# EAGLE design untitled (EAGLE 6.3)
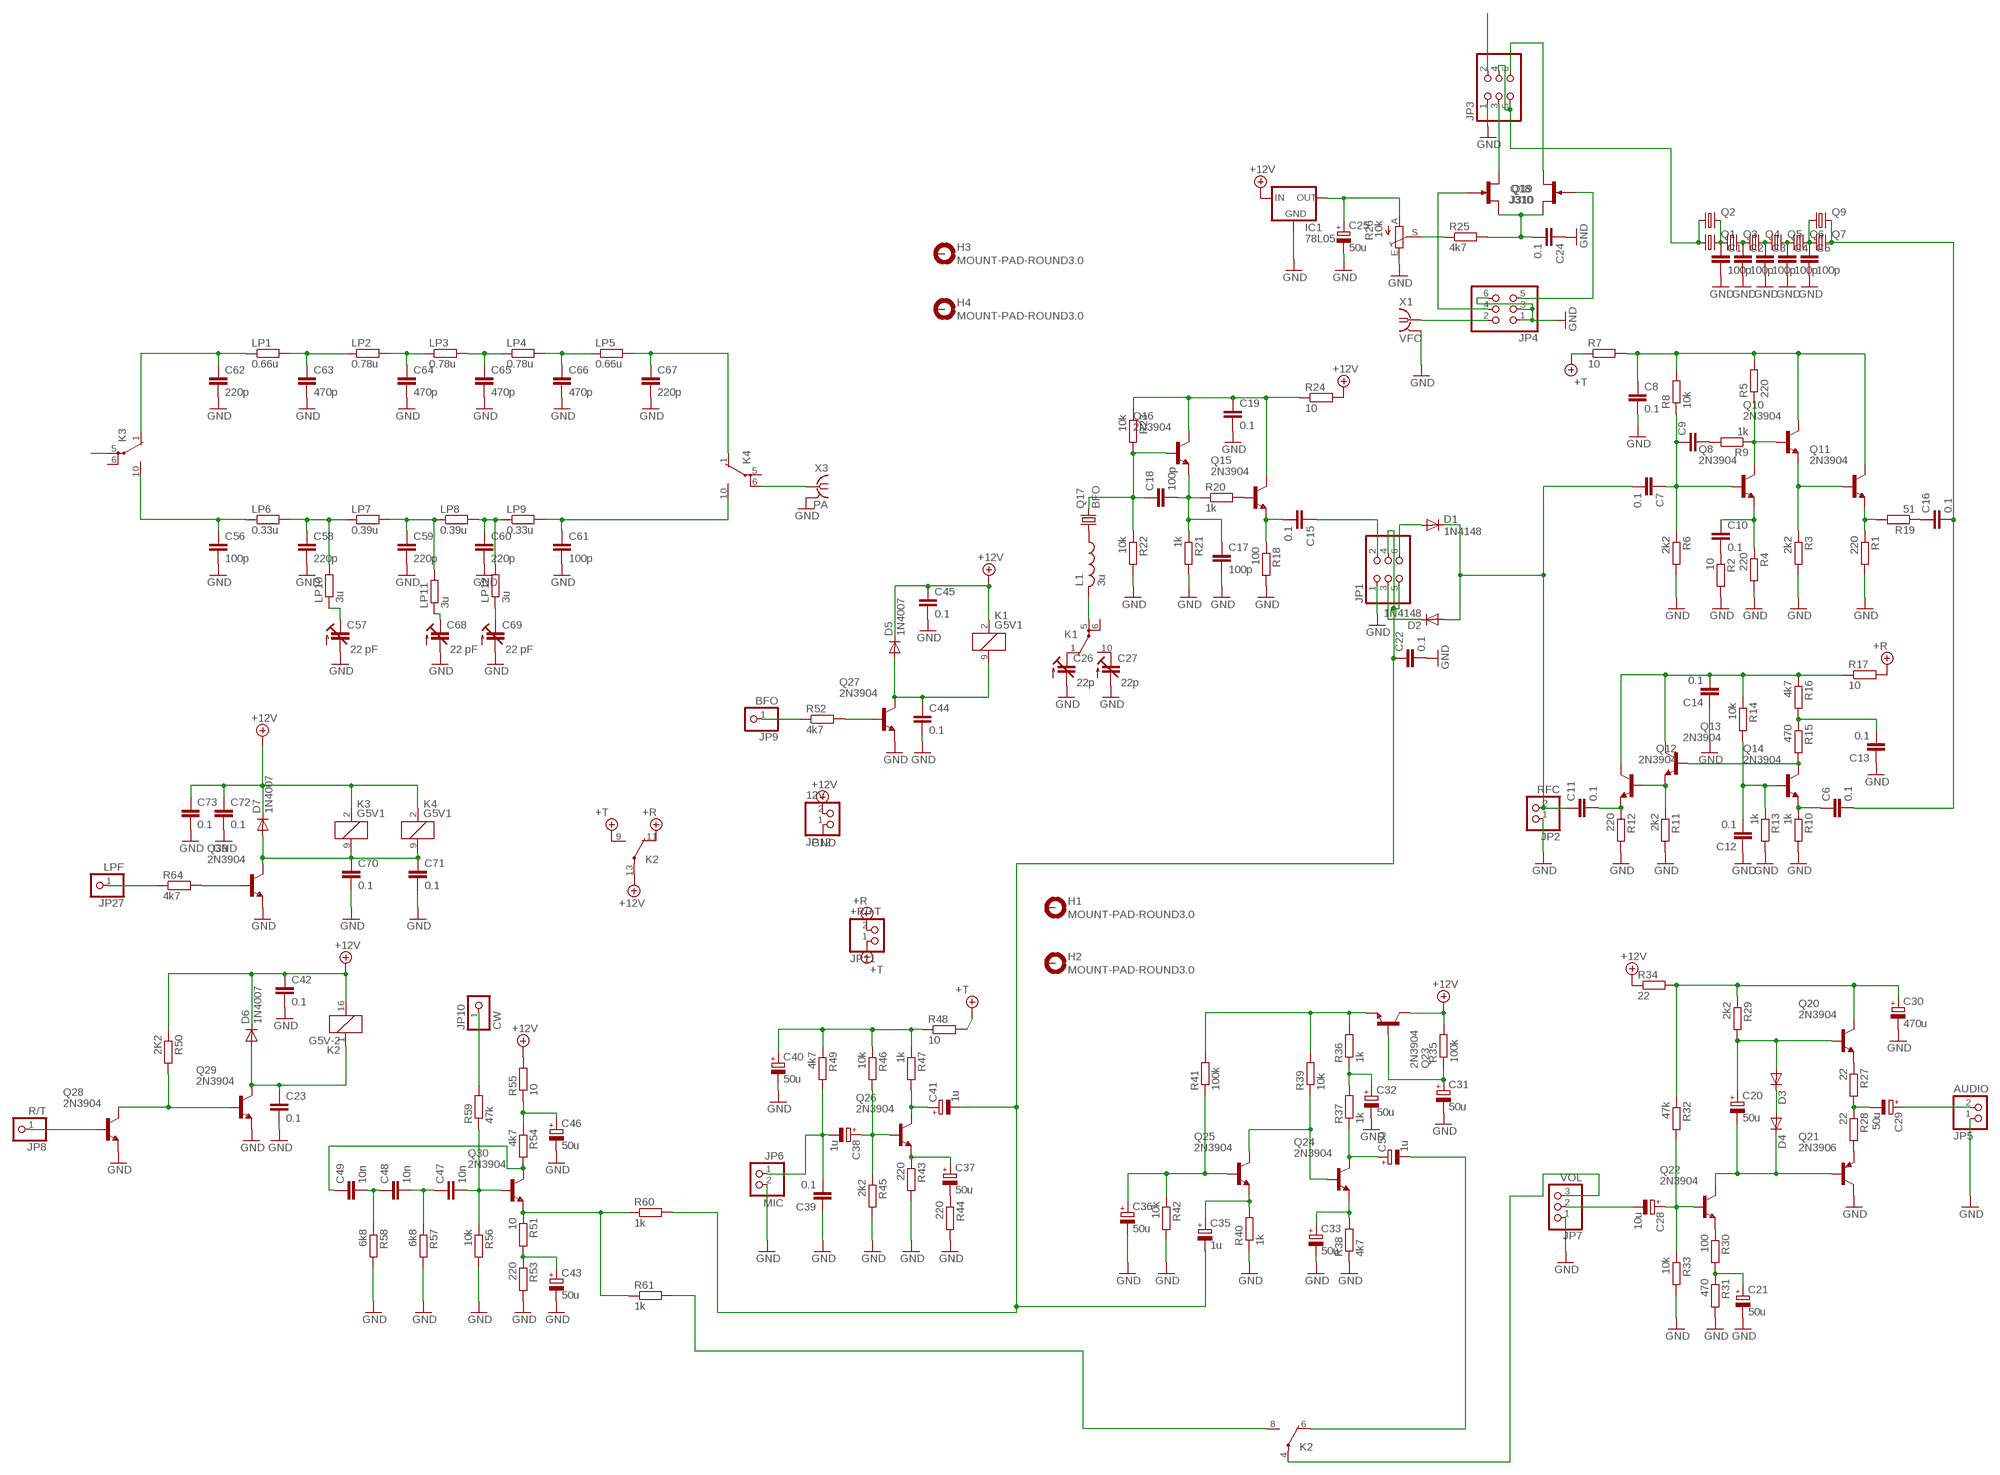
[diagram p0: schematic, sheet 1]

## Parts
C1  100p  C-EUC1206  [C1206]
C2  100p  C-EUC1206  [C1206]
C3  100p  C-EUC1206  [C1206]
C4  100p  C-EUC1206  [C1206]
C5  100p  C-EUC1206  [C1206]
C6  0.1  C-EU050-024X044  [C050-024X044]
C7  0.1  C-EU050-024X044  [C050-024X044]
C8  0.1  C-EU050-024X044  [C050-024X044]
C9  C-EU050-024X044  [C050-024X044]
C10  0.1  C-EU050-024X044  [C050-024X044]
C11  0.1  C-EU050-024X044  [C050-024X044]
C12  0.1  C-EU050-024X044  [C050-024X044]
C13  0.1  C-EU050-024X044  [C050-024X044]
C14  0.1  C-EU050-024X044  [C050-024X044]
C15  0.1  C-EU050-024X044  [C050-024X044]
C16  0.1  C-EU050-024X044  [C050-024X044]
C17  100p  C-EU050-024X044  [C050-024X044]
C18  100p  C-EU050-024X044  [C050-024X044]
C19  0.1  C-EU050-024X044  [C050-024X044]
C20  50u  CPOL-EUE2.5-5  [E2,5-5]
C21  50u  CPOL-EUE2.5-5  [E2,5-5]
C22  0.1  C-EU050-024X044  [C050-024X044]
C23  0.1  C-EU050-024X044  [C050-024X044]
C24  0.1  C-EU050-024X044  [C050-024X044]
C25  50u  CPOL-EUE2.5-5  [E2,5-5]
C26  22p  C-TRIMMTZ03  [CTRIMTZ03]
C27  22p  C-TRIMMTZ03  [CTRIMTZ03]
C28  10u  CPOL-EUE2.5-5  [E2,5-5]
C29  50u  CPOL-EUE2.5-5  [E2,5-5]
C30  470u  CPOL-EUE2.5-5  [E2,5-5]
C31  50u  CPOL-EUE2.5-5  [E2,5-5]
C32  50u  CPOL-EUE2.5-5  [E2,5-5]
C33  50u  CPOL-EUE2.5-5  [E2,5-5]
C35  1u  CPOL-EUE2.5-5  [E2,5-5]
C36  50u  CPOL-EUE2.5-5  [E2,5-5]
C37  50u  CPOL-EUE2.5-5  [E2,5-5]
C38  1u  CPOL-EUE2.5-5  [E2,5-5]
C39  0.1  C-EU050-024X044  [C050-024X044]
C40  50u  CPOL-EUE2.5-5  [E2,5-5]
C41  1u  CPOL-EUE2.5-5  [E2,5-5]
C42  0.1  C-EU050-024X044  [C050-024X044]
C43  50u  CPOL-EUE2.5-5  [E2,5-5]
C44  0.1  C-EU050-024X044  [C050-024X044]
C45  0.1  C-EU050-024X044  [C050-024X044]
C46  50u  CPOL-EUE2.5-5  [E2,5-5]
C47  10n  C-EU050-024X044  [C050-024X044]
C48  10n  C-EU050-024X044  [C050-024X044]
C49  10n  C-EU050-024X044  [C050-024X044]
C50  1u  CPOL-EUE5-4  [E5-4]
C56  100p  C-EU050-024X044  [C050-024X044]
C57  22 pF  C-TRIMMTZ03  [CTRIMTZ03]
C58  220p  C-EU050-024X044  [C050-024X044]
C59  220p  C-EU050-024X044  [C050-024X044]
C60  220p  C-EU050-024X044  [C050-024X044]
C61  100p  C-EU050-024X044  [C050-024X044]
C62  220p  C-EU050-024X044  [C050-024X044]
C63  470p  C-EU050-024X044  [C050-024X044]
C64  470p  C-EU050-024X044  [C050-024X044]
C65  470p  C-EU050-024X044  [C050-024X044]
C66  470p  C-EU050-024X044  [C050-024X044]
C67  220p  C-EU050-024X044  [C050-024X044]
C68  22 pF  C-TRIMMTZ03  [CTRIMTZ03]
C69  22 pF  C-TRIMMTZ03  [CTRIMTZ03]
C70  0.1  C-EU050-024X044  [C050-024X044]
C71  0.1  C-EU050-024X044  [C050-024X044]
C72  0.1  C-EU050-024X044  [C050-024X044]
C73  0.1  C-EU050-024X044  [C050-024X044]
D1  1N4148  DIODE-D-5  [D-5]
D2  1N4148  DIODE-D-5  [D-5]
D3  DIODE-D-5  [D-5]
D4  DIODE-D-5  [D-5]
D5  1N4007  DIODE-D-5  [D-5]
D6  1N4007  DIODE-D-5  [D-5]
D7  1N4007  DIODE-D-5  [D-5]
H1  MOUNT-PAD-ROUND3.0  [3,0-PAD]
H2  MOUNT-PAD-ROUND3.0  [3,0-PAD]
H3  MOUNT-PAD-ROUND3.0  [3,0-PAD]
H4  MOUNT-PAD-ROUND3.0  [3,0-PAD]
IC1  78L05  78LXX  [78LXX]
JP1  PINHD-2X3  [2X03]
JP2  RFC  PINHD-1X2  [1X02]
JP3  PINHD-2X3  [2X03]
JP4  PINHD-2X3  [2X03]
JP5  AUDIO  PINHD-1X2  [1X02]
JP6  MIC  PINHD-1X2  [1X02]
JP7  VOL  PINHD-1X3  [1X03]
JP8  R/T  PINHD-1X1  [1X01]
JP9  BFO  PINHD-1X1  [1X01]
JP10  CW  PINHD-1X1  [1X01]
JP11  +R/+T  PINHD-1X2  [1X02]
JP12  12V  PINHD-1X2  [1X02]
JP27  LPF  PINHD-1X1  [1X01]
K1  G5V1  [G5V1]
K2  G5V-2  [G5V-2]
K3  G5V1  [G5V1]
K4  G5V1  [G5V1]
L1  3u  L-US0207/2V  [0207/2V]
LP1  0.66u  R-EU_0204/5  [0204/5]
LP2  0.78u  R-EU_0204/5  [0204/5]
LP3  0.78u  R-EU_0204/5  [0204/5]
LP4  0.78u  R-EU_0204/5  [0204/5]
LP5  0.66u  R-EU_0204/5  [0204/5]
LP6  0.33u  R-EU_0204/5  [0204/5]
LP7  0.39u  R-EU_0204/5  [0204/5]
LP8  0.39u  R-EU_0204/5  [0204/5]
LP9  0.33u  R-EU_0204/5  [0204/5]
LP10  3u  R-EU_0204/5  [0204/5]
LP11  3u  R-EU_0204/5  [0204/5]
LP12  3u  R-EU_0204/5  [0204/5]
Q1  CRYSTALHC49S  [HC49/S]
Q2  CRYSTALHC49S  [HC49/S]
Q3  CRYSTALHC49S  [HC49/S]
Q4  CRYSTALHC49S  [HC49/S]
Q5  CRYSTALHC49S  [HC49/S]
Q6  CRYSTALHC49S  [HC49/S]
Q7  CRYSTALHC49S  [HC49/S]
Q8  2N3904  [TO92]
Q9  CRYSTALHC49S  [HC49/S]
Q10  2N3904  [TO92]
Q11  2N3904  [TO92]
Q12  2N3904  [TO92]
Q13  2N3904  [TO92]
Q14  2N3904  [TO92]
Q15  2N3904  [TO92]
Q16  2N3904  [TO92]
Q17  BFO  CRYSTALHC49S  [HC49/S]
Q18  J310  [TO92R]
Q19  J310  [TO92R]
Q20  2N3904  [TO92]
Q21  2N3906  [TO92]
Q22  2N3904  [TO92]
Q23  2N3904  [TO92]
Q24  2N3904  [TO92]
Q25  2N3904  [TO92]
Q26  2N3904  [TO92]
Q27  2N3904  [TO92]
Q28  2N3904  [TO92]
Q29  2N3904  [TO92]
Q30  2N3904  [TO92]
Q39  2N3904  [TO92]
R1  220  R-EU_0204/5  [0204/5]
R2  10  R-EU_0204/5  [0204/5]
R3  2k2  R-EU_0204/5  [0204/5]
R4  220  R-EU_0204/5  [0204/5]
R5  220  R-EU_0204/5  [0204/5]
R6  2k2  R-EU_0204/5  [0204/5]
R7  10  R-EU_0204/5  [0204/5]
R8  10k  R-EU_0204/5  [0204/5]
R9  1k  R-EU_0204/5  [0204/5]
R10  1k  R-EU_0204/5  [0204/5]
R11  2k2  R-EU_0204/5  [0204/5]
R12  220  R-EU_0204/5  [0204/5]
R13  1k  R-EU_0204/5  [0204/5]
R14  10k  R-EU_0204/5  [0204/5]
R15  470  R-EU_0204/5  [0204/5]
R16  4k7  R-EU_0204/5  [0204/5]
R17  10  R-EU_0204/5  [0204/5]
R18  100  R-EU_0204/5  [0204/5]
R19  51  R-EU_0204/5  [0204/5]
R20  1k  R-EU_0204/5  [0204/5]
R21  1k  R-EU_0204/5  [0204/5]
R22  10k  R-EU_0204/5  [0204/5]
R23  10k  R-EU_0204/5  [0204/5]
R24  10  R-EU_0204/5  [0204/5]
R25  4k7  R-EU_0204/5  [0204/5]
R26  10k  TRIM_EU-CA6V  [CA6V]
R27  22  R-EU_0204/5  [0204/5]
R28  22  R-EU_0204/5  [0204/5]
R29  2k2  R-EU_0204/5  [0204/5]
R30  100  R-EU_0204/5  [0204/5]
R31  470  R-EU_0204/5  [0204/5]
R32  47k  R-EU_0204/5  [0204/5]
R33  10k  R-EU_0204/5  [0204/5]
R34  22  R-EU_0204/5  [0204/5]
R35  100k  R-EU_0204/5  [0204/5]
R36  1k  R-EU_0204/5  [0204/5]
R37  1k  R-EU_0204/5  [0204/5]
R38  4k7  R-EU_0204/5  [0204/5]
R39  10k  R-EU_0204/5  [0204/5]
R40  1k  R-EU_0204/5  [0204/5]
R41  100k  R-EU_0204/5  [0204/5]
R42  10k  R-EU_0204/5  [0204/5]
R43  220  R-EU_0204/5  [0204/5]
R44  220  R-EU_0204/5  [0204/5]
R45  2k2  R-EU_0204/5  [0204/5]
R46  10k  R-EU_0204/5  [0204/5]
R47  1k  R-EU_0204/5  [0204/5]
R48  10  R-EU_0204/5  [0204/5]
R49  4k7  R-EU_0204/5  [0204/5]
R50  2K2  R-EU_0204/5  [0204/5]
R51  10  R-EU_0204/5  [0204/5]
R52  4k7  R-EU_0204/5  [0204/5]
R53  220  R-EU_0204/5  [0204/5]
R54  4k7  R-EU_0204/5  [0204/5]
R55  10  R-EU_0204/5  [0204/5]
R56  10k  R-EU_0204/5  [0204/5]
R57  6k8  R-EU_0204/5  [0204/5]
R58  6k8  R-EU_0204/5  [0204/5]
R59  47k  R-EU_0204/5  [0204/5]
R60  1k  R-EU_0204/5  [0204/5]
R61  1k  R-EU_0204/5  [0204/5]
R64  4k7  R-EU_0204/5  [0204/5]
X1  VFO  BU-SMA-V  [BU-SMA-V]
X3  PA  BU-SMA-V  [BU-SMA-V]

## Nets
+5V/1: JP11.2 K2.11(2:O) R17.2 ; supply symbol labelled +R
+5V/2: JP11.1 K2.9(2:S) R7.1 R48.2 ; supply symbol labelled +T
+12V: C42.1 C45.1 C72.1 C73.1 D5.C D6.C D7.C IC1.IN JP12.2 K1.2 K2.13(2:P) K2.16 K3.2 K4.2 Q23.1(C) R24.2 R34.1 R35.2 R50.1 R55.2
GND: C1.2 C2.2 C3.2 C4.2 C5.2 C8.2 C12.1 C13.1 C14.1 C17.2 C19.2 C21.- C22.2 C23.2 C24.1 C25.- C26.2(A) C27.2(A) C30.- C31.- C32.- C33.- C36.- C39.1 C40.- C42.2 C43.- C44.2 C45.2 C46.- C56.2 C57.2(A) C58.2 C59.2 C60.2 C61.2 C62.2 C63.2 C64.2 C65.2 C66.2 C67.2 C68.2(A) C69.2(A) C70.2 C71.2 C72.2 C73.2 IC1.GND JP1.1 JP2.1 JP3.1 JP4.1 JP4.3 JP4.6 JP5.1 JP6.2 JP7.1 JP12.1 Q21.1(C) Q27.3(E) Q28.3(E) Q29.3(E) Q39.3(E) R1.2 R2.2 R3.2 R4.2 R6.2 R10.2 R11.2 R12.2 R13.2 R18.2 R21.2 R22.2 R26.E R31.2 R33.2 R38.1 R40.1 R42.2 R43.2 R44.2 R45.2 R53.2 R56.2 R57.2 R58.2 X1.2(GND) X3.2(GND)
N$1: C1.1 Q1.2 Q2.2 Q3.1
N$2: C2.1 Q3.2 Q4.1
N$3: C3.1 Q4.2 Q5.1
N$4: C4.1 Q5.2 Q6.1
N$5: C5.1 Q6.2 Q7.1 Q9.1
N$6: C6.2 C16.2 Q7.2 Q9.2
N$7: C26.1(E) K1.1(2:O)
N$8: C10.1 Q8.3(E) R4.1
N$9: C10.2 R2.1
N$10: C7.1 C9.1 Q8.2(B) R6.1 R8.1
N$11: Q8.1(C) Q10.2(B) R5.1 R9.1
N$12: Q10.3(E) Q11.2(B) R3.1
N$13: Q11.3(E) R1.1 R19.2
N$14: C8.1 Q10.1(C) Q11.1(C) R5.2 R7.2 R8.2
N$15: C16.1 R19.1
N$16: C9.2 R9.2
N$17: Q12.2(B) Q13.3(E) R11.1
N$18: C11.2 Q12.3(E) R12.1
N$19: C14.2 Q12.1(C) Q13.1(C) R14.1 R16.1 R17.1
N$20: C27.1(E) K1.10(2:S)
N$21: C12.2 Q14.2(B) R13.1 R14.2
N$22: C6.1 Q14.3(E) R10.1
N$23: Q13.2(B) Q14.1(C) R15.2
N$24: C13.2 R15.1 R16.2
N$25: C15.2 Q15.3(E) R18.1
N$26: Q15.2(B) R20.2
N$27: C17.1 C18.2 Q16.3(E) R20.1 R21.1
N$28: C19.1 Q15.1(C) Q16.1(C) R23.1 R24.1
N$29: C15.1 JP1.2
N$30: C18.1 Q16.2(B) Q17.2 R22.1 R23.2
N$31: L1.1 Q17.1
N$32: K1.5(2:P) L1.2
N$33: R25.1 R26.S
N$34: Q20.3(E) R27.1
N$35: Q27.2(B) R52.2
N$36: D1.A JP1.6
N$37: D2.C JP1.3
N$38: C7.2 C11.1 D1.C D2.A JP2.2
N$39: JP3.4 JP3.5 Q1.1 Q2.1
N$40: JP3.3 Q18.D
N$41: JP3.6 Q19.D
N$42: C24.2 Q18.S Q19.S R25.2
N$43: JP4.5 Q19.G
N$44: JP4.4 Q18.G
N$45: C29.- R27.2 R28.1
N$46: JP4.2 X1.1
N$47: Q21.3(E) R28.2
N$48: C25.+ IC1.OUT R26.A
N$49: D3.C D4.A
N$50: C20.- D4.C Q21.2(B) Q22.1(C)
N$51: C20.+ D3.A Q20.2(B) R29.2
N$52: C30.+ Q20.1(C) R29.1 R32.1 R34.2
N$53: Q22.3(E) R30.1
N$54: C21.+ R30.2 R31.1
N$55: C28.+ Q22.2(B) R32.2 R33.1
N$56: C29.+ JP5.2
N$57: C28.- JP7.2
N$58: C31.+ Q23.2(B) R35.1
N$59: Q23.3(E) R36.2 R39.2 R41.2
N$60: C32.+ R36.1 R37.2
N$61: C50.+ Q24.1(C) R37.1
N$62: C33.+ Q24.3(E) R38.2
N$63: Q24.2(B) Q25.1(C) R39.1
N$64: JP9.1 R52.1
N$65: C35.+ Q25.3(E) R40.2
N$66: C36.+ Q25.2(B) R41.1 R42.1
N$67: C37.+ Q26.3(E) R43.1
N$68: C37.- R44.1
N$69: C38.+ Q26.2(B) R45.1 R46.2
N$70: C41.+ Q26.1(C) R47.2
N$71: C40.+ R46.1 R47.1 R48.1 R49.1
N$72: C38.- C39.2 JP6.1 R49.2
N$73: JP7.3 K2.4(1:P)
N$74: C22.1 C35.- C41.- JP1.4 JP1.5 R60.2
N$75: C50.- K2.6(1:O)
N$76: JP8.1 Q28.2(B)
N$77: C23.1 D6.A K2.1 Q29.1(C)
N$78: Q28.1(C) Q29.2(B) R50.2
N$79: C44.1 D5.A K1.9 Q27.1(C)
N$80: C57.1(E) LP10.1
N$81: Q30.3(E) R51.1 R60.1 R61.1
N$82: C43.+ R51.2 R53.1
N$83: C49.1 Q30.1(C) R54.2
N$84: C46.+ R54.1 R55.1
N$85: C47.2 Q30.2(B) R56.1 R59.1
N$86: C47.1 C48.2 R57.1
N$87: C48.1 C49.2 R58.1
N$88: C68.1(E) LP11.1
N$89: JP10.1 R59.2
N$91: K2.8(1:S) R61.2
N$104: C56.1 K3.10(2:S) LP6.1
N$105: C58.1 LP6.2 LP7.1 LP10.2
N$106: C59.1 LP7.2 LP8.1 LP11.2
N$107: C60.1 LP8.2 LP9.1 LP12.2
N$108: C61.1 K4.10(2:S) LP9.2
N$109: C62.1 K3.1(2:O) LP1.1
N$110: C63.1 LP1.2 LP2.1
N$111: C64.1 LP2.2 LP3.1
N$112: C65.1 LP3.2 LP4.1
N$113: C66.1 LP4.2 LP5.1
N$114: C67.1 K4.1(2:O) LP5.2
N$115: K4.6(2:P) X3.1
N$116: JP3.2 K3.5(2:P)
N$119: C69.1(E) LP12.1
N$120: Q39.2(B) R64.2
N$121: JP27.1 R64.1
N$122: C70.1 C71.1 D7.A K3.9 K4.9 Q39.1(C)
Unconnected: H1.B3,0(MOUNT) H2.B3,0(MOUNT) H3.B3,0(MOUNT) H4.B3,0(MOUNT) K1.6(2:P) K3.6(2:P) K4.5(2:P)

## Power pins joined to a net without a drawn wire
GND: X1.3(GND) X1.4(GND) X1.5(GND) X3.3(GND) X3.4(GND) X3.5(GND)

## Library data of the parts
C1-C19 C22-C24 C39 C42 C44 C45 C47-C49 C56 C58-C67 C70-C73 = rcl:C-EU: CAPACITOR, European symbol
C20 C21 C25 C28-C33 C35-C38 C40 C41 C43 C46 C50 = rcl:CPOL-EU: POLARIZED CAPACITOR, European symbol
C26 C27 C57 C68 C69 = rcl:C-TRIMM: Trimm capacitor
D1-D7 = diode:DIODE-: DIODE
H1-H4 = holes:MOUNT-PAD-ROUND: MOUNTING PAD, round
IC1 = v-reg:78LXX: VOLTAGE REGULATOR
JP1 JP3 JP4 = pinhead:PINHD-2X3: PIN HEADER
JP2 JP5 JP6 JP11 JP12 = pinhead:PINHD-1X2: PIN HEADER
JP7 = pinhead:PINHD-1X3: PIN HEADER
JP8-JP10 JP27 = pinhead:PINHD-1X1: PIN HEADER
K1 K3 K4 = relay:G5V1: RELAY 1 x switch, 0.5 A/125 V AC, 1 A/24 V DC , Omron; MPN: G5V-1-DC24; OC_FARNELL: 9949593; OC_NEWARK: 36M6377
K2 = relay:G5V-2: OMRON PCB Relay Source: http://www.omron.com/ecb/products/pdf/en-g5v2.pdf; MPN: G5V-2 5DC; OC_FARNELL: 9949488; OC_NEWARK: 78K5703
L1 = rcl:L-US: INDUCTOR, American symbol
LP1-LP12 R1-R25 R27-R61 R64 = rcl:R-EU_: RESISTOR, European symbol
Q1-Q7 Q9 Q17 = crystal:CRYSTAL: CRYSTAL; OC_FARNELL: 1667008; OC_NEWARK: unknown
Q8 Q10-Q16 Q20 Q22-Q30 Q39 = transistor-npn:2N3904: NPN Transistor
Q18 Q19 = transistor-small-signal:J310: N-Channel RF Amplifier J309, J310 Source: http://www.fairchildsemi.com/pf/J3/J310.html
Q21 = transistor-pnp:2N3906: PNP Transistor
R26 = pot:TRIM_EU-: POTENTIOMETER
X1 X3 = con-coax:BU-SMA-V: FEMALE SMA CONNECTOR Radiall distributor RS 112-3794; OC_FARNELL: unknown; OC_NEWARK: unknown

## Board
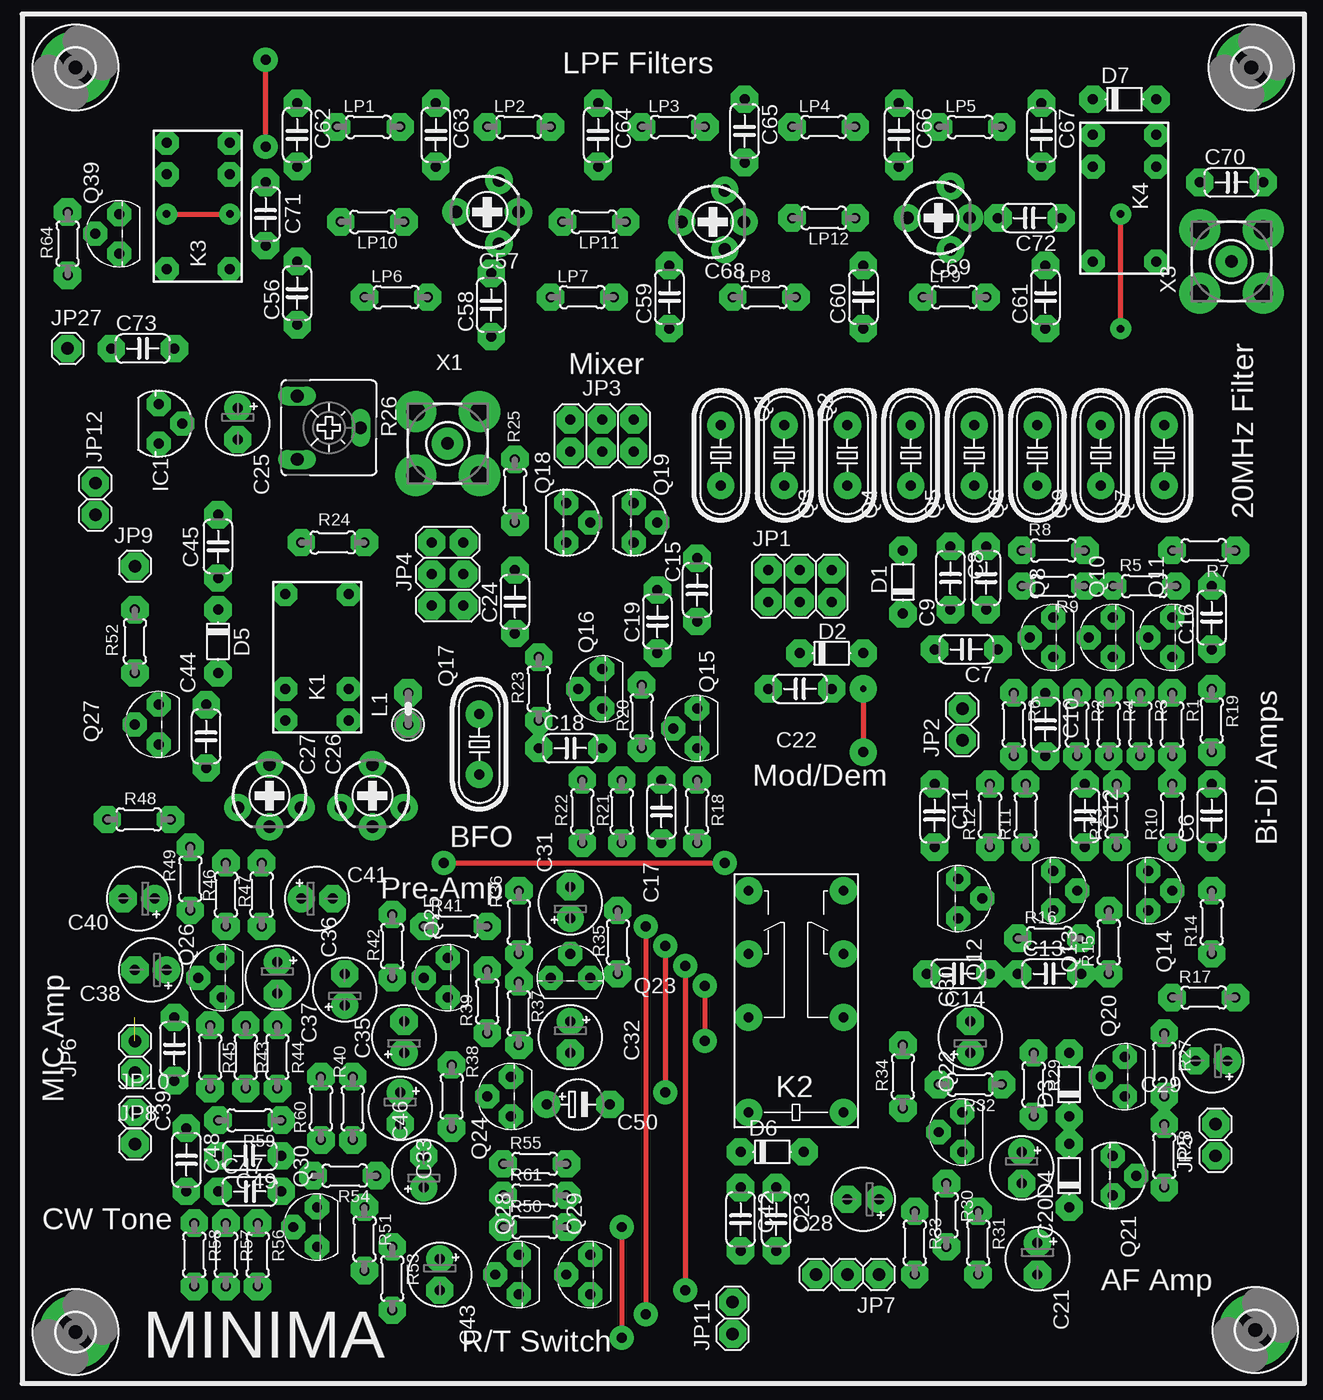
[diagram p1: board, top side]
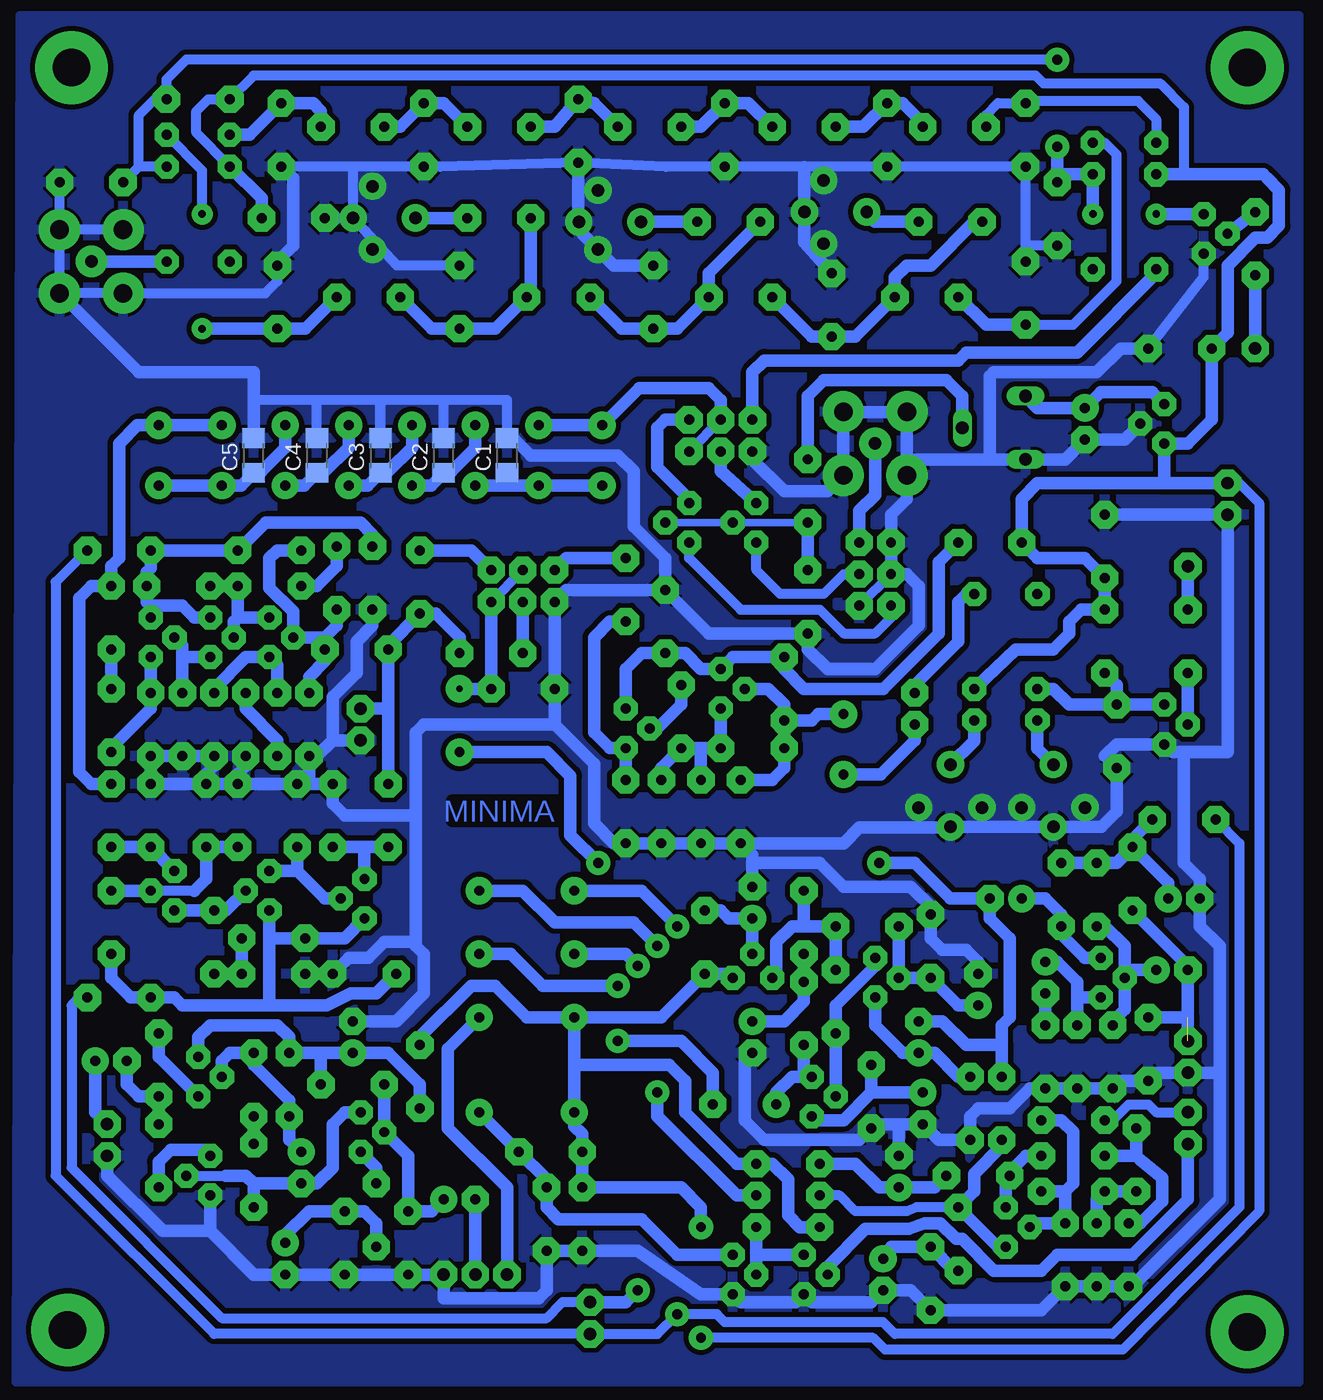
[diagram p2: board, bottom side, seen from below]

No outline drawn. Coordinates in mm, seen from the top.
Copper layers (1*16): Top 0.035mm / dielectric 1.5mm / Bottom 0.035mm
Design rules "default": minimum track width 10mil, minimum drill 24mil, track to track 8mil, track to pad 8mil, pad to pad 8mil, via to via 8mil, smd to smd 8mil, copper to edge 40mil, drill to drill 8mil, minimum pad ring 10mil, minimum via ring 8mil, stop-mask expansion 4mil, vias tented up to drill 0mil, thermal gap 10mil

### Footprints (pad centres in the part's own frame; a part is rotated, then mirrored left to right if it is on the bottom)
C1206 = smd 1.6 x 1.8: 1 -1.4,0; 2 1.4,0
C050-024X044 = drill 0.8 pad 2.184 octagon: 1 -2.54,0; 2 2.54,0
E2,5-5 = drill 0.8 pad 2.184: + -1.27,0 | drill 0.8 pad 2.184 octagon: - 1.27,0
CTRIMTZ03 = drill 1 pad 2.184: 1 0,2.5; 2 0,-2.5
E5-4 = drill 0.8 pad 2.184: + -2.54,0 | drill 0.8 pad 2.184 octagon: - 2.54,0
D-5 = drill 0.8 pad 2.184 octagon: A 2.54,0; C -2.54,0
3,0-PAD = drill 3 pad 5.842: B3,0 0,0
78LXX = drill 0.8 pad 1.93 octagon: GND 0,1.905; IN 1.587,0; OUT -1.587,0
2X03 = drill 0.8 pad 2.184 octagon: 1 -2.54,-1.27; 2 -2.54,1.27; 3 0,-1.27; 4 0,1.27; 5 2.54,-1.27; 6 2.54,1.27
1X02 = drill 1 pad 2.184 octagon: 1 -1.27,0; 2 1.27,0
1X03 = drill 1 pad 2.184 octagon: 1 -2.54,0; 2 0,0; 3 2.54,0
1X01 = drill 1 pad 2.184 octagon: 1 0,0
G5V1 = drill 0.8 pad 1.93 octagon: 1 -5.08,-2.54; 2 -2.54,-2.54; 5 5.08,-2.54; 6 5.08,2.54; 9 -2.54,2.54; 10 -5.08,2.54
G5V-2 = drill 0.8 pad 2.184: 1 -8.89,-3.81; 4 -1.27,-3.81; 6 3.81,-3.81; 8 8.89,-3.81; 9 8.89,3.81; 11 3.81,3.81; 13 -1.27,3.81; 16 -8.89,3.81
0207/2V = drill 0.8 pad 2.184 octagon: 1 -1.27,0; 2 1.27,0
0204/5 = drill 0.8 pad 2.184 octagon: 1 -2.54,0; 2 2.54,0
HC49/S = drill 0.8 pad 2.184: 1 -2.413,0; 2 2.413,0
TO92 = drill 0.8 pad 1.93 octagon: 1 1.587,0; 2 0,1.905; 3 -1.587,0
TO92R = drill 0.8 pad 1.93 octagon: D -1.587,0; G 1.587,0; S 0,1.905
CA6V = drill 1.016 long: A -2.54,-2.54; E 2.54,-2.54; S 0,2.54
BU-SMA-V = drill 1 pad 2.54: 1 0,0 | drill 1.5 pad 3.302: 2 -2.55,2.55; 3 2.55,2.55; 4 2.55,-2.55; 5 -2.55,-2.55

### Placement (x,y rotation side)
C1  62.23,72.71 90 bottom
C2  67.31,72.71 90 bottom
C3  72.39,72.71 90 bottom
C4  77.47,72.71 90 bottom
C5  82.55,72.71 90 bottom
C6  93.98,43.81 90 top
C7  74.3,57.15 180 top
C8  73.03,62.87 270 top
C9  75.88,62.87 90 top
C10  80.64,51.12 270 top
C11  71.75,43.81 270 top
C12  83.82,43.81 270 top
C13  80.96,31.11 0 top
C14  73.66,31.11 180 top
C15  52.7,61.91 270 top
C16  93.98,59.69 90 top
C17  49.85,44.13 270 top
C18  42.55,49.21 0 top
C19  49.53,59.37 90 top
C20  78.74,15.56 270 top
C21  80.01,8.26 270 top
C22  60.96,53.98 180 top
C23  59.05,11.43 270 top
C24  38.1,60.96 90 top
C25  15.88,75.25 270 top
C26  26.67,45.4 0 top
C27  18.41,45.4 0 top
C28  66.04,13.02 180 top
C29  93.98,24.13 180 top
C30  74.61,26.04 90 top
C31  42.55,36.83 90 top
C32  42.55,26.04 270 top
C33  28.89,20.32 270 top
C35  29.21,26.04 90 top
C36  24.45,29.84 90 top
C37  19.05,30.8 270 top
C38  8.89,31.43 180 top
C39  10.79,25.08 90 top
C40  7.94,37.15 180 top
C41  22.23,37.15 0 top
C42  56.2,11.43 270 top
C43  32.07,6.99 270 top
C44  13.34,50.16 270 top
C45  14.29,65.41 90 top
C46  30.8,15.24 90 top
C47  16.83,13.65 0 top
C48  11.75,16.19 270 top
C49  16.83,16.51 180 top
C50  43.18,20.64 0 top
C56  20.64,85.72 90 top
C57  35.88,92.23 90 top
C58  36.2,84.77 90 top
C59  50.48,85.41 90 top
C60  66.04,85.41 90 top
C61  80.64,85.41 90 top
C62  20.64,98.42 270 top
C63  31.75,98.42 270 top
C64  44.77,98.42 270 top
C65  56.52,98.74 270 top
C66  68.9,98.42 270 top
C67  80.33,98.42 270 top
C68  53.98,91.44 90 top
C69  72.07,91.76 90 top
C70  95.57,94.61 0 top
C71  18.1,92.08 270 top
C72  79.38,91.76 180 top
C73  8.26,81.28 0 top
D1  69.22,62.55 90 top
D2  63.5,56.83 0 top
D3  82.55,22.23 90 top
D4  82.55,14.92 90 top
D5  14.29,57.78 270 top
D6  58.74,16.83 0 top
D7  87,101.28 0 top
H1  2.86,2.38 0 top
H2  97.47,2.54 0 top
H3  2.86,103.82 0 top
H4  97.16,103.82 0 top
IC1  9.53,75.25 270 top
JP1  60.96,62.23 0 top
JP2  73.98,51.12 90 top
JP3  45.09,74.3 0 top
JP4  32.7,63.18 270 top
JP5  94.3,17.78 90 top
JP6  7.62,24.45 270 top
JP7  64.77,6.99 180 top
JP8  7.62,17.46 0 top
JP9  7.62,63.82 0 top
JP10  7.62,20 0 top
JP11  55.56,3.49 90 top
JP12  4.45,69.22 90 top
JP27  2.22,81.28 0 top
K1  22.23,56.52 90 top
K2  60.64,28.89 90 top
K3  12.7,92.71 270 top
K4  87,93.34 270 top
L1  29.53,52.39 90 top
LP1  26.35,99.06 0 top
LP2  38.42,99.06 0 top
LP3  50.8,99.06 0 top
LP4  62.87,99.06 0 top
LP5  74.61,99.06 0 top
LP6  28.57,85.41 0 top
LP7  43.5,85.41 0 top
LP8  58.1,85.41 0 top
LP9  73.34,85.41 0 top
LP10  26.67,91.44 180 top
LP11  44.45,91.44 180 top
LP12  62.87,91.76 180 top
Q1  54.61,72.71 270 top
Q2  59.69,72.71 270 top
Q3  64.77,72.71 90 top
Q4  69.85,72.71 90 top
Q5  74.93,72.71 90 top
Q6  80.01,72.71 90 top
Q7  90.17,72.71 90 top
Q8  81.28,58.1 90 top
Q9  85.09,72.71 90 top
Q10  86.04,58.1 90 top
Q11  90.81,58.1 90 top
Q12  73.66,37.15 270 top
Q13  81.28,37.78 270 top
Q14  88.9,37.78 270 top
Q15  52.7,50.8 90 top
Q16  45.09,53.98 90 top
Q17  35.24,49.53 90 top
Q18  42.23,67.31 270 top
Q19  47.62,67.31 270 top
Q20  87,22.86 90 top
Q21  86.04,14.92 270 top
Q22  73.98,18.41 90 top
Q23  42.55,30.8 0 top
Q24  37.78,21.27 90 top
Q25  32.7,30.8 90 top
Q26  14.61,30.8 90 top
Q27  9.53,51.12 90 top
Q28  38.42,6.99 90 top
Q29  44.13,6.99 90 top
Q30  22.23,10.79 90 top
Q39  6.35,90.49 90 top
R1  90.81,51.12 270 top
R2  83.19,51.12 270 top
R3  88.27,51.12 270 top
R4  85.72,51.12 270 top
R5  88.58,62.23 0 top
R6  78.11,51.12 270 top
R7  93.34,65.09 180 top
R8  81.28,65.09 0 top
R9  81.28,62.23 180 top
R10  90.81,43.81 90 top
R11  79.06,43.81 90 top
R12  76.2,43.81 90 top
R13  86.36,43.81 90 top
R14  93.98,35.24 90 top
R15  85.72,33.66 90 top
R16  80.96,33.97 0 top
R17  93.34,29.21 0 top
R18  52.7,44.13 270 top
R19  93.98,51.44 270 top
R20  48.26,51.75 90 top
R21  46.67,44.13 270 top
R22  43.5,44.13 270 top
R23  40.01,53.98 270 top
R24  23.5,65.72 180 top
R25  38.1,69.85 270 top
R26  23.18,74.93 270 top
R27  90.17,23.81 270 top
R28  90.17,16.51 270 top
R29  79.69,22.23 270 top
R30  72.71,11.75 270 top
R31  75.25,9.53 270 top
R32  74.61,22.23 180 top
R33  70.17,9.53 270 top
R34  69.22,22.86 270 top
R35  46.35,33.66 270 top
R36  38.42,35.24 90 top
R37  38.42,27.94 90 top
R38  33.02,21.27 90 top
R39  35.88,28.89 90 top
R40  25.08,20.32 90 top
R41  33.34,34.92 0 top
R42  28.26,33.34 90 top
R43  16.51,24.45 270 top
R44  19.05,24.45 270 top
R45  13.65,24.45 270 top
R46  14.92,37.47 270 top
R47  17.78,37.47 270 top
R48  7.94,43.5 180 top
R49  12.06,38.73 270 top
R50  39.69,10.79 0 top
R51  26.04,9.84 270 top
R52  7.62,57.78 270 top
R53  28.26,6.67 270 top
R54  24.45,14.92 180 top
R55  39.69,15.88 0 top
R56  17.46,8.57 270 top
R57  14.92,8.57 270 top
R58  12.38,8.57 270 top
R59  16.83,19.37 180 top
R60  22.54,20.32 90 top
R61  39.69,13.34 0 top
R64  2.22,89.69 90 top
X1  32.7,73.66 0 top
X3  95.57,88.27 90 top

### Tracks (layer width: path | path; a pad name or v marks a point on that pad's centre or on a via)
+5V/1  (via drill 0.8 pad 1.93)
  Top 0.406: v51.75,31.75 v51.75,5.71
  Bottom 0.813: R17.2 96.52,29.21 97.16,28.57 97.16,15.56 85.09,3.49 59.05,3.49 57.78,4.76 JP11.2
  Bottom 1.016: v51.75,31.75 52.7,32.7 K2.11 | v51.75,5.71 52.7,4.76 JP11.2
+5V/2  (via drill 0.8 pad 1.93)
  Top 0.406: v48.58,34.92 v48.58,3.81
  Bottom 0.813: R7.1 98.42,62.55 98.42,14.92 85.72,2.22 JP11.1 50.16,2.22 v48.58,3.81 45.4,3.81 44.77,3.17 32.07,3.17 31.11,2.22 13.65,2.22 3.49,12.38 3.49,41.59 R48.2
  Bottom 1.016: v48.58,34.92 51.44,37.78 K2.9
+12V  (via drill 0.8 pad 1.93)
  Top 0.406: v46.67,10.79 v46.67,1.91
  Bottom 0.813: JP12.2 3.49,70.48 1.91,68.9 1.91,12.06 12.86,0.95 31.91,0.95 32.86,1.91 v46.67,1.91 | 0.64,94.3 1.27,94.93 | 7.94,95.25 7.94,100.65 9.84,102.55 19.21,102.55 19.84,103.19 82.55,103.19 D7.C 86.2,101.28 87.15,100.33 87.15,98.58 K4.2
  Bottom 1.016: R34.1 69.22,26.04 65.09,30.16 63.18,30.16 60.64,27.62 K2.13 | K2.13 49.85,27.62 R35.2 44.45,31.11 Q23.1 | 56.83,23.81 K2.16 56.83,18.89 56.2,18.26 D6.C C42.1 48.26,13.97 46.67,12.38 v46.67,10.79 | 56.83,23.81 K2.13 | 56.83,23.81 49.21,23.81 47.94,22.54 47.94,20 43.81,15.88 R55.2 40.96,15.88 39.69,14.61 39.69,11.75 38.73,10.79 R50.1 | 9.53,70.48 JP12.2 | 9.53,70.48 IC1.IN 7.62,73.66 5.71,75.56 C73.1 4.45,82.55 4.45,87.95 2.22,90.17 1.27,90.17 0.32,91.12 0.32,93.98 1.27,94.93 1.59,95.25 7.94,95.25 K3.2 | 9.53,70.48 19.68,70.48 20.95,69.22 R24.2 19.68,64.45 15.88,64.45 C45.1 D5.C 16.19,60.33 17.14,59.37 17.14,58.42 18.41,57.15 21.43,57.15 24.61,54.13 K1.2 | C72.1 81.92,93.34 K4.2
GND  (via drill 1 pad 2.18)
  Bottom 0.813: 69.53,33.34 69.53,33.66 | 30.16,73.64 X1.5 30.14,72.39 | 35.24,73.64 X1.4 | X1.2 30.15,76.19 30.16,76.2 | X1.3 | C1.2 62.23,77.15 67.31,77.15 | C2.2 67.31,77.15 | 67.31,77.15 72.07,77.15 | 72.07,77.15 72.39,77.15 | 72.39,77.15 C3.2 72.39,76.83 72.07,77.15 | 72.39,77.15 77.47,77.15 | C4.2 77.47,77.15 | 77.47,77.15 82.55,77.15 | C63.2 C62.2 20.64,89.53 | C63.2 38.42,95.89 | 38.42,95.89 C64.2 49.53,95.89 | 49.53,95.89 C65.2 67.63,95.89 | 67.63,95.89 C66.2 74.93,95.89 | 74.93,95.89 C67.2 | C56.2 20.64,89.53 | 31.71,95.84 C63.2 | 49.49,95.84 49.53,95.89 | 67.59,95.84 67.63,95.89 | C69.2 74.57,95.84 74.93,95.89 | C60.2 71.08,87.95 C69.2 | 38.38,95.84 38.42,95.89 | X3.4 X3.3 93.01,90.81 | X3.4 X3.5 X3.2 81.61,85.72 80.64,86.68 C61.2 | X3.4 C70.2 | C72.2 C69.2 | C71.2 20.64,89.53 | C73.2 6.35,87 Q39.3 | JP4.3 JP4.6
  Bottom 1.016: 86.04,10.48 82.55,6.99 C21.- R31.2 R33.2 JP7.1 67.31,5.08 59.69,5.08 59.05,5.71 C23.2 C42.2 51.75,8.89 46.67,5.4 Q29.3 43.5,4.76 39.05,4.76 Q28.3 37.78,4.76 33.02,4.76 C43.- 29.84,5.71 R53.2 19.37,4.13 R56.2 R57.2 R58.2 12.06,6.03 5.08,13.02 5.08,23.18 | 86.04,10.48 Q21.1 | 86.04,10.48 89.85,10.48 94.3,14.92 JP5.1 | C13.1 C14.1 74.93,32.38 73.34,32.38 72.07,33.66 69.53,33.66 69.53,44.13 | C30.- 71.12,27.3 68.9,29.53 68.9,32.7 69.53,33.34 | 78.11,46.35 R12.2 76.2,44.77 75.25,43.81 69.85,43.81 69.53,44.13 | 78.11,46.35 R11.2 C12.1 83.98,46.35 | R13.2 R10.2 R1.2 R3.2 R4.2 85.72,47.78 86.36,47.15 R13.2 | 78.11,46.35 R6.2 77.47,48.58 76.2,49.85 | JP2.1 76.2,49.85 | 76.2,49.85 76.2,53.34 74.3,55.24 74.3,57.78 73.03,59.05 C8.2 | 58.42,51.12 68.9,51.12 69.53,50.48 69.53,44.13 | C19.2 57.47,61.91 JP1.1 C22.2 58.42,51.12 | 23.5,72.39 23.5,79.06 23.18,79.38 14.92,79.38 13.02,81.28 C73.2 | C5.2 82.55,79.38 91.78,79.38 X3.5 | 30.8,19.05 C33.- 27.62,17.78 R40.1 25.08,19.68 24.45,20.32 21.91,20.32 20.32,21.91 R44.2 R43.2 R45.2 13.02,22.54 C39.1 10.16,23.18 JP6.2 5.08,23.18 | 30.8,19.05 32.7,19.05 R38.1 33.97,17.78 41.59,17.78 43.18,19.37 43.18,24.13 C32.- | C46.- 30.8,19.05 | C31.- 42.55,40.01 | 42.55,40.01 42.55,40.64 R22.2 | 42.55,40.01 37.15,40.01 35.24,38.1 29.84,38.1 28.26,36.51 R42.2 28.26,33.97 27.3,33.02 25.4,33.02 24.45,32.07 C36.- | 5.08,23.18 5.08,33.34 6.67,34.92 C40.- 6.67,38.73 7.94,40.01 7.94,48.58 8.26,48.9 | 8.26,48.9 8.89,48.9 Q27.3 13.34,49.53 14.29,48.58 C44.2 13.34,44.13 14.56,42.9 C27.2 C26.2 26.07,42.86 33.97,42.86 35.24,41.59 R22.2 | 8.26,48.9 4.45,48.9 JP12.1 C45.2
  Bottom 1.016: R22.2 R21.2 C17.2 R18.2 53.66,41.59 55.24,43.18 55.24,47.94 58.42,51.12 | C19.2 46.04,58.42 C24.1 38.1,57.15 36.51,55.56 32.7,55.56 29.21,59.05 29.21,62.23 30.16,63.18 JP4.3 JP4.1 31.43,67.94 30.16,69.22 30.16,71.1 X1.5 30.15,76.19 | IC1.GND 12.7,73.98 C25.- 17.46,72.39 R26.E 23.5,72.39 | 23.5,72.39 30.14,72.39 | X1.3 X1.4 36.51,69.85 40.01,69.85 42.55,72.39 JP3.1 | X1.3 30.16,76.2 X1.2 | C19.2 49.53,64.45 52.07,66.99 52.07,71.44 53.34,72.71 60.33,72.71 61.59,73.98 62.1,73.98 C1.2 | C61.2 80.64,88.27 79.38,89.53 79.38,94.93 C67.2 | C58.2 38.38,89.81 C57.2 38.38,95.84 | C59.2 53.66,87.95 56.16,90.45 C68.2 56.52,92.11 C65.2 | R2.2 83.19,47.78 83.82,47.15 83.82,46.51 83.98,46.35 | 83.98,46.35 R13.2
  other vias: 15.88,44.45 24.13,44.45 29.21,44.45 20.95,44.45 36.83,94.77 36.83,89.69 54.93,89.22 54.93,93.98 73.03,94.3 73.03,89.22
  pour Bottom (isolate 0.406): -1.27,107.95 101.28,107.95 101.6,-1.59 -1.27,-1.59
N$1
  Bottom 1.016: Q1.2 Q2.2 62.23,70.29 | 62.23,70.29 Q3.1 | C1.1 62.23,70.29
N$2
  Bottom 0.813: 67.12,71.12 C2.1
  Bottom 1.016: Q3.2 64.77,73.34 66.67,71.44 67.18,71.44 C2.1 68.32,70.29 Q4.1
N$3
  Bottom 1.016: Q4.2 69.85,73.34 71.75,71.44 72.26,71.44 C3.1 73.4,70.29 Q5.1
N$4
  Bottom 1.016: Q5.2 74.93,73.34 76.83,71.44 77.34,71.44 C4.1 78.48,70.29 Q6.1
N$5
  Bottom 1.016: Q7.1 Q9.1 83.56,70.29 C5.1 82.42,71.44 81.92,71.44 80.01,73.34 Q6.2
N$6
  Bottom 1.016: C6.2 95.57,46.35 96.52,47.31 96.52,61.28 95.57,62.23 C16.2 93.98,63.82 93.34,64.45 93.34,73.66 91.89,75.12 Q7.2 Q9.2
N$7
  Bottom 1.016: K1.1 24.77,49.81 C26.1
N$8
  Bottom 1.016: C10.1 80.64,55.88 Q8.3 83.19,56.52 85.72,53.98 R4.1
N$9
  Bottom 1.016: C10.2 80.64,49.85 83.19,52.39 R2.1
N$10
  Bottom 1.016: R6.1 78.11,54.93 76.83,56.2 C7.1 76.83,58.1 | C9.1 75.88,59.05 76.83,58.1 | 76.83,58.1 Q8.2 79.38,60.17 81.28,62.07 81.28,64.45 80.64,65.09 R8.1
N$11
  Bottom 1.016: Q10.2 84.14,59.37 83.82,59.69 | 83.82,59.69 Q8.1 | 83.82,59.69 R9.1 R5.1
N$12
  Bottom 1.016: R3.1 88.27,56.83 | 88.27,56.83 88.27,57.47 Q11.2 | Q10.3 87.95,56.52 88.27,56.83
N$13
  Bottom 1.016: R19.2 93.98,49.21 90.81,52.39 R1.1 Q11.3
N$14
  Bottom 1.016: Q10.1 87.31,59.69 88.27,60.64 90.81,60.64 | 90.81,60.64 Q11.1 | 90.81,60.64 91.12,60.96 R5.2 91.12,63.34 90.81,63.66 R7.2 R8.2 81.6,67.31 73.98,67.31 73.03,66.36 C8.1
N$15
  Bottom 1.016: R19.1 C16.1
N$16
  Bottom 1.016: R9.2 77.47,62.23 75.88,63.82 C9.2
N$17
  Bottom 1.016: Q12.2 76.83,37.15 79.06,39.37 | 79.06,39.37 Q13.3 | R11.1 79.06,39.37
N$18
  Bottom 1.016: C11.2 73.66,41.27 | 73.66,41.27 R12.1 | Q12.3 73.66,41.27
N$19
  Bottom 1.016: C14.2 72.71,29.53 74.77,29.53 76.68,28.57 81.28,28.57 | 81.28,28.57 88.27,28.57 88.9,29.21 R17.1 92.39,29.21 93.98,30.8 R14.1 | Q12.1 75.25,33.97 R16.1 81.28,33.97 | 81.28,33.97 81.28,28.57 | Q13.1 81.28,33.97
N$20
  Bottom 1.016: K1.10 19.68,49.17 C27.1
N$21
  Bottom 0.813: 87.31,37.78 Q14.2
  Bottom 1.016: R14.2 Q14.2 | C12.2 R13.1 86.36,38.73 87.31,37.78
N$22
  Bottom 1.016: C6.1 R10.1 Q14.3
N$23
  Bottom 1.016: Q14.1 R15.2 84.77,36.2 Q13.2
N$24
  Bottom 1.016: R16.2 C13.2 R15.1
N$25
  Bottom 1.016: R18.1 Q15.3 53.98,49.21 55.24,50.48 55.24,58.1 53.98,59.37 C15.2
N$26
  Bottom 1.016: Q15.2 50.16,50.8 48.26,52.7 R20.2
N$27
  Bottom 1.016: C17.1 49.85,47.62 R20.1 46.67,49.21 | 46.67,49.21 C18.2 Q16.3 | R21.1 46.67,49.21
N$28
  Bottom 1.016: Q15.1 52.7,55.56 51.44,56.83 C19.1 47.94,56.83 46.67,55.56 Q16.1 44.13,56.52 R23.1 40.01,55.56 38.42,53.98 32.07,53.98 27.62,58.42 27.62,64.14 R24.1
N$29
  Bottom 1.016: C15.1 57.47,64.45 JP1.2
N$30
  Bottom 1.016: R22.1 40.96,46.67 40.01,47.62 C18.1 R23.2 | Q16.2 41.27,53.98 40.01,52.7 R23.2 | Q17.2 37.27,51.94 37.78,51.44 R23.2
N$31
  Bottom 1.016: Q17.1 32.26,47.12 29.53,49.85 L1.1
N$32
  Bottom 1.016: K1.5 25.4,61.59 26.04,60.96 26.04,57.78 29.53,54.29 L1.2
N$33
  Bottom 1.016: R26.S 25.72,77.47 26.99,78.74 36.83,78.74 38.1,77.47 R25.1
N$34
  Bottom 1.016: R27.1 90.17,24.45 Q20.3
N$35
  Bottom 1.016: R52.2 Q27.2
N$36
  Bottom 1.016: D1.A 65.09,65.09 JP1.6
N$37
  Bottom 1.016: JP1.3 D2.C
N$38
  Bottom 1.016: C11.1 71.75,52.39 | 71.75,52.39 C7.2 71.75,57.47 D1.C 67.94,60.01 66.04,58.1 D2.A | JP2.2 71.75,52.39
N$39
  Bottom 0.813: JP3.4 JP3.5
  Bottom 1.016: Q2.1 Q1.1 51.63,78.11 46.04,78.11 45.09,77.15 JP3.4
N$40
  Bottom 1.016: Q18.D 45.09,71.44 JP3.3
N$41
  Bottom 1.016: Q19.D 47.62,69.22 50.16,71.75 50.16,74.93 49.53,75.56 JP3.6
N$42
  Bottom 0.61: R25.2 Q18.S Q19.S
  Bottom 1.016: C24.2 R25.2
N$43
  Bottom 0.813: Q19.G 47.62,64.45 43.5,60.33 37.15,60.33 35.24,58.42 32.7,58.42 31.43,59.69 JP4.5
N$44
  Bottom 0.813: Q18.G 42.23,63.5 40.32,61.59 36.83,61.59 35.24,63.18 JP4.4
N$45
  Bottom 1.016: C29.- 92.71,22.23 91.76,21.27 R27.2 R28.1
N$46
  Bottom 1.016: JP4.2 33.97,68.26 32.7,69.53 X1.1
N$47
  Bottom 1.016: Q21.3 86.52,16.99 89.22,16.99 90.17,16.03 R28.2
N$48
  Bottom 1.016: IC1.OUT 10.48,77.79 14.61,77.79 C25.+ 19.68,76.52 R26.A
N$49
  Bottom 1.016: D4.A D3.C
N$50
  Bottom 0.813: Q21.2 84.77,14.92
  Bottom 1.016: Q22.1 75.25,20 76.2,19.05 76.2,15.56 77.47,14.29 C20.- 82.55,14.29 | D4.C 82.55,14.29 | 84.77,14.92 83.19,14.92 82.55,14.29
N$51
  Bottom 1.016: C20.+ 79.69,17.78 R29.2 79.69,20.95 82.55,23.81 D3.A 84.45,24.77 85.09,24.13 Q20.2
N$52
  Bottom 1.016: Q20.1 87,26.04 86.04,26.99 80.64,26.99 79.69,26.04 R29.1 77.15,24.77 | 77.15,24.77 C30.+ 71.75,24.77 69.22,22.23 R34.2 | R32.1 77.15,24.77
N$53
  Bottom 1.016: Q22.3 72.71,15.56 R30.1
N$54
  Bottom 1.016: C21.+ 80.01,10.16 78.11,12.06 R31.1 73.66,12.06 72.71,11.11 R30.2
N$55
  Bottom 1.016: C28.+ 68.26,12.06 R33.1 70.17,16.51 Q22.2 R32.2
N$56
  Bottom 1.016: C29.+ 95.25,20 JP5.2
N$57
  Bottom 1.016: JP7.2 C28.-
N$58
  Bottom 1.016: R35.1 45.09,36.2 44.45,35.56 C31.+ Q23.2
N$59
  Bottom 1.016: R39.2 R41.2 38.73,34.92 | 38.73,34.92 39.37,34.92 40.64,33.66 40.64,31.11 Q23.3 | R36.2 38.42,35.24 38.73,34.92
N$60
  Bottom 1.016: C32.+ 40.01,27.3 38.42,28.89 R37.2 R36.1
N$61
  Bottom 1.016: C50.+ 40.64,21.59 39.37,22.86 38.42,22.86 | 38.42,22.86 Q24.1 | R37.1 38.42,22.86
N$62
  Bottom 1.016: Q24.3 37.47,19.68 37.15,19.37 35.24,19.37 33.02,21.59 | 33.02,21.59 C33.+ | R38.2 33.02,21.59
N$63
  Bottom 1.016: Q24.2 R39.1 35.88,28.57 32.7,31.75 Q25.1
N$64
  Bottom 1.016: JP9.1 R52.1
N$65
  Bottom 1.016: R40.2 26.04,22.86 27.94,24.77 C35.+ 30.48,24.77 32.7,26.99 Q25.3
N$66
  Bottom 1.016: C36.+ 26.04,28.57 R42.1 Q25.2 R41.1
N$67
  Bottom 1.016: R43.1 16.51,29.53 | 16.51,29.53 16.51,30.48 18.1,32.07 C37.+ | Q26.3 16.19,29.21 16.51,29.53
N$68
  Bottom 1.016: R44.1 C37.-
N$69
  Bottom 1.016: R45.1 13.65,27.3 12.7,28.26 Q26.2 12.7,31.43 | 12.7,31.43 12.7,33.34 14.29,34.92 R46.2 | C38.+ 12.7,31.43
N$70
  Bottom 1.016: Q26.1 15.88,32.38 17.78,34.29 R47.2 17.78,35.88 19.05,37.15 C41.+
N$71
  Bottom 1.016: R47.1 R46.1 13.34,40.01 R49.1 | R49.1 12.06,41.91 R48.1 | C40.+ 9.21,38.42 R49.1
N$72  (1 unrouted)
  Bottom 1.016: C39.2 7.62,27.62 | JP6.1 C38.- 7.62,31.75 R49.2
N$73
  Bottom 1.016: JP7.3 62.23,13.97 66.99,18.73 66.99,25.08 K2.4
N$74  (via drill 0.5 pad 2.18, 0.8 pad 1.93, 0.8 pad 2.18)
  Top 0.406: v32.38,40.01 v54.93,40.01 | v66.04,53.98 v66.04,48.9
  Bottom 0.813: JP1.5 JP1.4
  Bottom 1.016: JP1.5 C22.1 v66.04,53.98 | v66.04,48.9 59.05,48.9 57.15,46.99 57.15,42.23 v54.93,40.01 | C35.- 27.3,27.3 25.4,25.4 22.54,25.4 | 22.54,25.4 R60.2 | 22.54,25.4 22.54,26.99 21.91,27.62 21.91,33.97 23.5,35.56 C41.- 26.67,37.15 29.53,40.01 v32.38,40.01
N$75  (via drill 0.8 pad 1.93)
  Top 0.406: v53.34,30.16 v53.34,25.72
  Bottom 1.016: v53.34,30.16 59.37,30.16 61.91,32.7 K2.6 | v53.34,25.72 48.26,25.72 45.72,23.18 C50.-
N$76
  Bottom 1.016: JP8.1 7.62,13.02 12.06,8.57 18.1,8.57 19.37,7.3 23.18,7.3 25.72,9.84 26.19,9.84 27.46,11.11 28.73,11.11 30,10.64 33.5,10.64 36.51,7.62 Q28.2
N$77
  Bottom 1.016: Q29.1 48.58,8.57 51.44,11.43 58.1,11.43 59.05,12.38 C23.1 59.05,14.61 D6.A K2.1
N$78
  Bottom 1.016: R50.2 42.23,8.89 | 42.23,8.89 Q29.2 | Q28.1 41.91,8.57 42.23,8.89
N$79
  Bottom 1.016: C44.1 Q27.1 | K1.9 18.41,53.98 17.14,52.7 C44.1 | D5.A 13.34,54.29 C44.1
N$80
  Bottom 1.016: LP10.1 32.74,91.44 C57.1
N$81
  Bottom 0.813: R51.1 29.37,12.38 30.16,12.06 34.29,12.06 35.56,13.34 R61.1
  Bottom 1.016: Q30.3 22.86,9.21 R51.1 24.77,13.65 24.77,15.08 22.54,17.3 R60.1
N$82
  Bottom 1.016: R51.2 26.35,7.3 R53.1 31.43,9.21 32.07,8.57 C43.+
N$83
  Bottom 1.016: Q30.1 22.23,14.61 R54.2 21.91,15.24 20.64,16.51 C49.1
N$84
  Bottom 1.016: R55.1 34.29,15.88 32.38,13.97 C46.+ 27.94,13.97 R54.1
N$85
  Bottom 1.016: Q30.2 20,10.79 19.68,11.11 R56.1 17.46,13.65 | C47.2 17.46,13.65 | 17.46,13.65 16.83,14.29 16.83,18.41 17.78,19.37 R59.1
N$86
  Bottom 1.016: R57.1 14.92,13.02 C47.1 C48.2
N$87
  Bottom 1.016: R58.1 11.43,11.11 9.68,12.86 9.68,14.76 11.43,16.19 11.75,16.51 | 11.75,16.51 C49.2 | C48.1 11.75,16.51
N$88
  Bottom 1.016: C68.1 LP11.1
N$89
  Bottom 0.813: R59.2 13.65,19.37 12.38,20.64 10.79,20.64 10.16,20 JP10.1
N$91  (via drill 0.8 pad 1.93)
  Top 0.406: v50.16,33.34 v50.16,21.59
  Bottom 1.016: v50.16,33.34 52.07,35.24 58.42,35.24 60.96,37.78 K2.8 | R61.2 43.81,13.34 50.16,19.68 v50.16,21.59
N$104
  Bottom 0.813: C56.1 16.83,83.19 13.34,86.68 13.34,96.84 14.29,97.79 K3.10
  Bottom 1.016: C56.1 23.81,83.19 LP6.1
N$105
  Bottom 1.016: LP7.1 37.78,82.23 C58.1 34.29,82.23 LP6.2 31.11,87 30.16,87.95 28.26,87.95 24.77,91.44 LP10.2
N$106
  Bottom 1.016: LP8.1 53.02,82.87 C59.1 48.58,82.87 LP7.2 46.04,87.31 LP11.2
N$107
  Bottom 1.016: LP9.1 68.26,82.87 C60.1 63.18,82.87 LP8.2 60.33,85.72 LP12.2
N$108  (via drill 0.6 pad 1.68)
  Top 0.406: v86.68,82.87 v86.68,92.08
  Bottom 0.813: v86.68,92.08 86.68,95.57 K4.10
  Bottom 1.016: LP9.2 78.42,82.87 C61.1 v86.68,82.87
N$109
  Bottom 0.813: LP1.1 23.81,100.01 22.86,100.97 C62.1 20.48,101.12 11.59,101.12 10.16,99.69 K3.1
N$110
  Bottom 1.016: LP2.1 33.66,99.06 C63.1 30.48,100.97 28.89,99.38 LP1.2
N$111
  Bottom 1.016: LP2.2 42.86,100.97 C64.1 46.67,99.06 LP3.1
N$112
  Bottom 1.016: LP3.2 55.24,100.97 C65.1 58.42,99.06 LP4.1
N$113
  Bottom 1.016: LP4.2 67.31,100.97 C66.1 70.8,99.06 LP5.1
N$114
  Bottom 1.016: K4.1 82.87,98.42 C67.1 77.79,100.97 77.15,100.33 LP5.2
N$115
  Bottom 1.016: K4.6 X3.1
N$116
  Bottom 1.016: JP3.2 42.55,79.38 41.59,80.33 26.04,80.33 25.4,80.96 16.51,80.96 10.16,87.31 K3.5
N$119
  Bottom 1.016: C69.1 LP12.1
N$120
  Bottom 1.016: Q39.2 R64.2
N$121
  Bottom 1.016: JP27.1 R64.1
N$122  (via drill 0.6 pad 1.68, 0.8 pad 1.93)
  Top 0.406: v10.16,92.08 v15.24,92.08 | v18.1,97.47 v18.1,104.46
  Bottom 0.813: K4.9 91.76,95.89 | 91.76,95.89 91.76,100.01 90.49,101.28 D7.A 89.53,102.87 87.95,104.46 v18.1,104.46 | C70.1 91.76,95.89
  Bottom 1.016: Q39.1 v10.16,92.08 | v15.24,92.08 K3.9 18.1,95.25 | v18.1,97.47 18.1,95.25 | 18.1,95.25 C71.1

### Text on the board
Bottom: MINIMA
tPlace: LPF Filters | Mixer | 20MHz Filter | Mod/Dem | BFO | Bi-Di Amps | Pre-Amp | MIC Amp | CW Tone | AF Amp | R/T Switch | MINIMA